# Altium schematic sheet I2C-Magnetometer-sensor.SchDoc: =ProjectTitle
size 297 x 209 mm; Address1: Address1; Address2: Address2; Address3: Address3; Address4: Address4; SheetNumber: 13; SheetTotal: 18; Scale: 1:1; DocumentType: Схема электрическая принципиальная
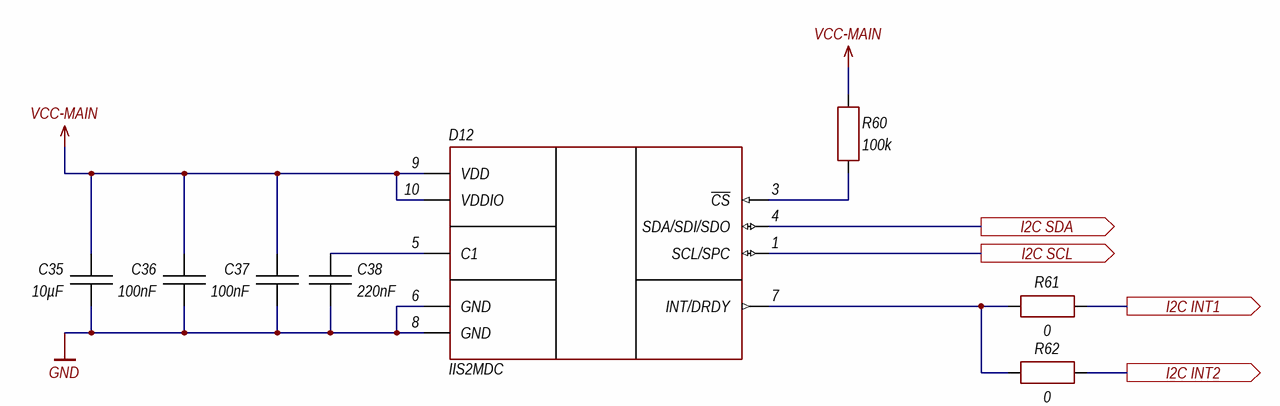
[diagram p0: I2C-Magnetometer-sensor.SchDoc]

## Parts
C35  10µF  [CH0402C]
C36  100nF  [CH0402C]
C37  100nF  [CH0402C]
C38  220nF  [CH0402C]
D12  IIS2MDC  [12-LGA (2x2mm)]
R60  100k  [CH0402R]
R61  0  [CH0402R]
R62  0  [CH0402R]

## Ports
I2C INT1 (out), I2C INT2 (out), I2C SCL (out), I2C SDA (out)

## Nets
GND: C35.1 C36.1 C37.1 C38.1 D12.6(GND) D12.8(GND)
VCC-MAIN: C35.2 C36.2 C37.2 D12.9(VDD) D12.10(VDDIO) R60.2
I2C INT1: R61.1 ; port I2C INT1
I2C INT2: R62.1 ; port I2C INT2
I2C SCL: D12.1(SCL/SPC) ; port I2C SCL
I2C SDA: D12.4(SDA/SDI/SDO) ; port I2C SDA
NetC38_2: C38.2 D12.5(C1)
NetD12_3: D12.3(~{CS}) R60.1
NetD12_7: D12.7(INT/DRDY) R61.2 R62.2

## Notes on the sheet
- Изм.
- Лист
- № докум.
- Подп.
- Дата
- Копировал
- Формат А4

## Library data of the parts
C35-C38 = Capacitor: Manufacturer: *; Model: *; HelpURL: *; ComponentKind: *
  C35: Value: 10µF
  C36 C37: Value: 100nF
  C38: Value: 220nF
D12 = IIS2MDC: 3-axis magnetometer, I2C/SPI; Manufacturer: STMicroelectronics; Model: IIS2MDC; HelpURL: https://lcsc.com/product-detail/Magnetic-Sensors_STMicroelectronics-IIS2MDCTR_C2655002.html; ComponentKind: 1.71-3.6V, X/Y/Z, ±50 gauss, I2C/SPI
R60-R62 = Resistor: Manufacturer: *; Model: *; HelpURL: *; ComponentKind: *
  R60: Value: 100k
  R61 R62: Value: 0